# Altium schematic sheet GPS.SchDoc
size A4
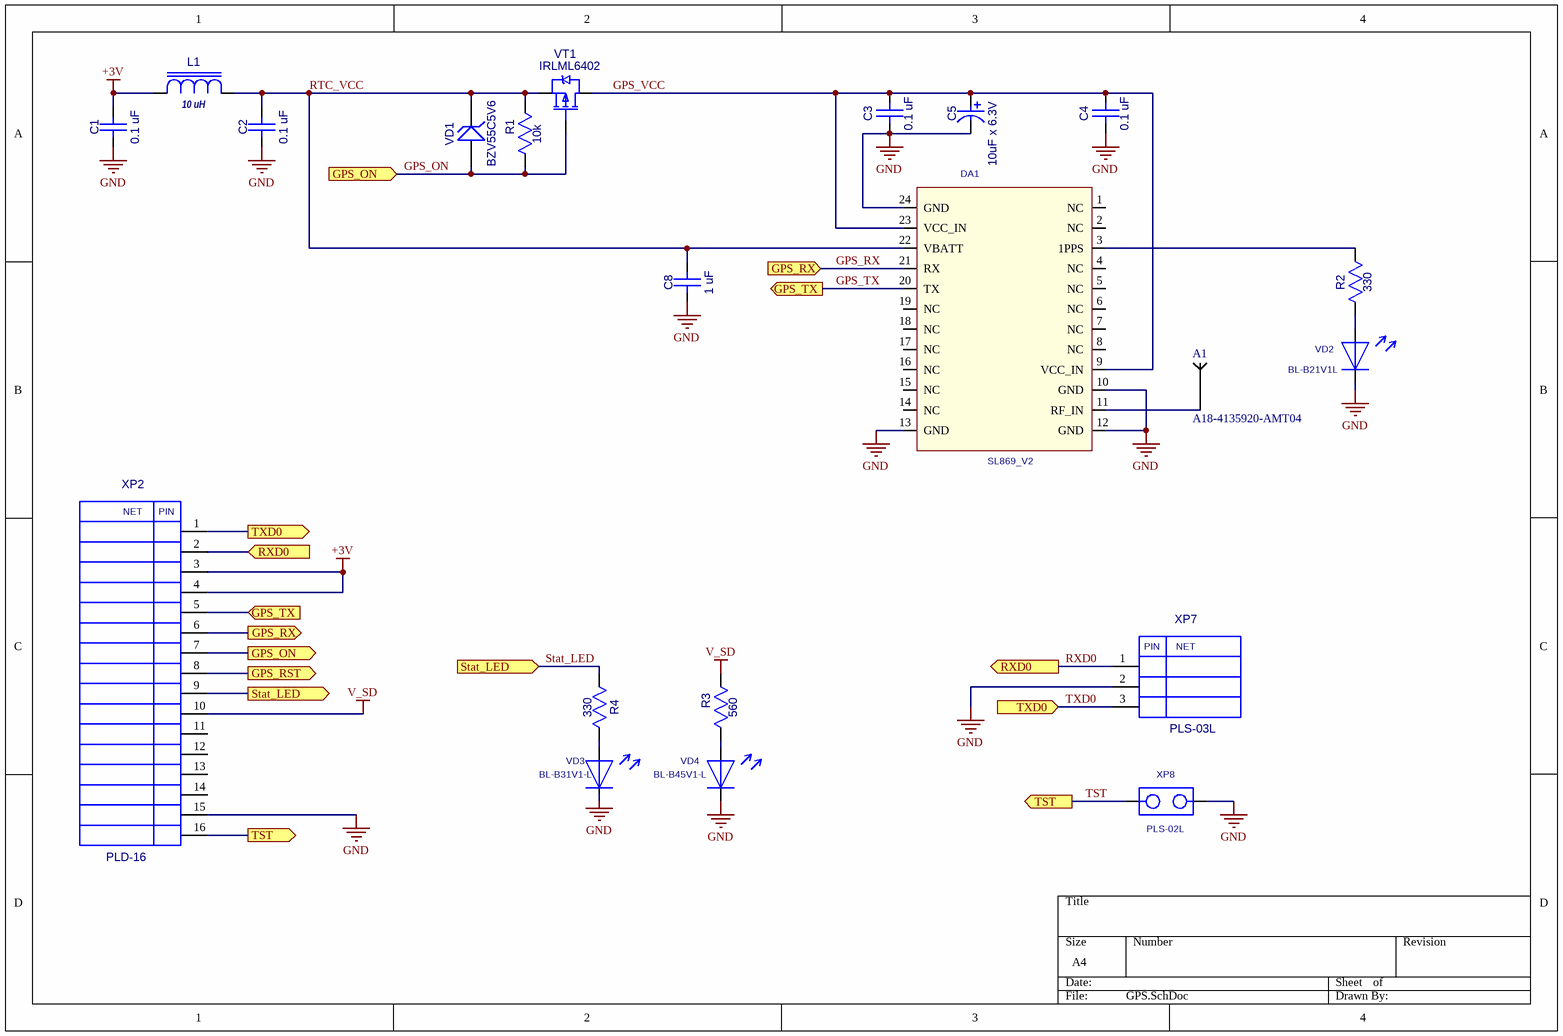
[diagram p0: GPS.SchDoc]

## Parts
A1  A18-4135920-AMT04  [BY-GPS-204]
C1  0.1 uF  [CC0603-3M]
C2  0.1 uF  [CC0603-3M]
C3  0.1 uF  [CC0603-3M]
C4  0.1 uF  [CC0603-3M]
C5  10uF x 6.3V  [TAJ-A_M]
C8  1 uF  [CC0603-3M]
DA1  SL869_V2  [SL868]
L1  10 uH  [RC0805-MIDI-2]
R1  10k  [RC0603-3M]
R2  330  [RC0603-3M]
R3  560  [RC0603-3M]
R4  330  [RC0603-3M]
VD1  BZV55C5V6  [SOD80]
VD2  BL-B21V1L  [LED3]
VD3  BL-B31V1-L  [LED3]
VD4  BL-B45V1-L  [LED3]
VT1  IRLML6402  [SOT-23(123)]
XP2  PLD-16  [PIN16]
XP7  PLS-03L  [PLS-03L]
XP8  PLS-02L  [PLS-02L]

## Ports
GPS_ON (in), GPS_ON (out), GPS_RST (out), GPS_RX (in), GPS_RX (out), GPS_TX (in), GPS_TX (out), RXD0 (in), RXD0 (out), Stat_LED (in), Stat_LED (out), TST (out), TXD0 (in), TXD0 (out)

## Nets
+3V: C1.2(B) L1.1(A) XP2.3 XP2.4
GND: C1.1(A) C2.1(A) C3.2(B) C4.2(B) C5.2(B) C8.1(A) DA1.10(GND) DA1.12(GND) DA1.13(GND) DA1.24(GND) VD2.1 VD3.1 VD4.1 XP2.15 XP7.2 XP8.2
V_SD: R3.2(B) XP2.10
GPS_ON: R1.2(B) VD1.1(A) VT1.1(G) XP2.7 ; port GPS_ON
GPS_RST: XP2.8 ; port GPS_RST
GPS_RX: DA1.21(RX) XP2.6 ; port GPS_RX
GPS_TX: DA1.20(TX) XP2.5 ; port GPS_TX
GPS_VCC: C3.1(A) C4.1(A) C5.1(A) DA1.9(VCC_IN) DA1.23(VCC_IN) VT1.3(D)
RTC_VCC: C2.2(B) C8.2(B) DA1.22(VBATT) L1.2(B) R1.1(A) VD1.2 VT1.2(S)
RXD0: XP2.2 XP7.1 ; port RXD0
Stat_LED: R4.2(B) XP2.9 ; port Stat_LED
TST: XP2.16 XP8.1 ; port TST
TXD0: XP2.1 XP7.3 ; port TXD0
NetA1_1: A1.1 DA1.11(RF_IN)
NetDA1_3: DA1.3(1PPS) R2.1(A)
NetR2_2: R2.2(B) VD2.2
NetR3_1: R3.1(A) VD4.2
NetR4_1: R4.1(A) VD3.2

Not connected (* = marked no-connect by the designer): DA1 1(NC) 2(NC) 4(NC) 5(NC) 6(NC) 7(NC) 8(NC) 14(NC) 15(NC) 16(NC) 17(NC) 18(NC) 19(NC); XP2 11 12 13 14

## Notes on the sheet
- (in symbol PLD-16) NET; PIN
- (in symbol PLS-03L) PIN; NET

## Library data of the parts
A1 = BY-GPS-204: Passive GPS Antenna
C1-C4 C8 = CC0603
  C1-C4: Value: 0.1 uF
  C8: Value: 1 uF
C5 = TAJ-A: Value: 10uF x 6.3V
L1 = L0805: Value: 10 uH
R1-R4 = RC0603
  R1: Value: 10k
  R2 R4: Value: 330
  R3: Value: 560
VD1 = BZV55C5V1: Zener Voltage Regulator Diode; OriginalName: BZX84C10LT1; ComponentField6: Pin 2 is not connected and not drawn.; ComponentField7: Published 29-Sep-2000; Value: BZV55C5V6
VD2-VD4 = LED_3
  VD2: Value: BL-B21V1L
  VD3: Value: BL-B31V1-L
  VD4: Value: BL-B45V1-L
VT1 = IRLML6402: HEXFET Power MOSFET; OriginalName: IRLML5103; Value: {Value}; ComponentField7: Published 8-Jun-2000
DA1 = SL869_V2: Value: *
XP2 = PLD-16: Value: *
XP7 = PLS-03L: Value: *
XP8 = PLS-02L: Value: *